# Altium project driver.PrjPcb
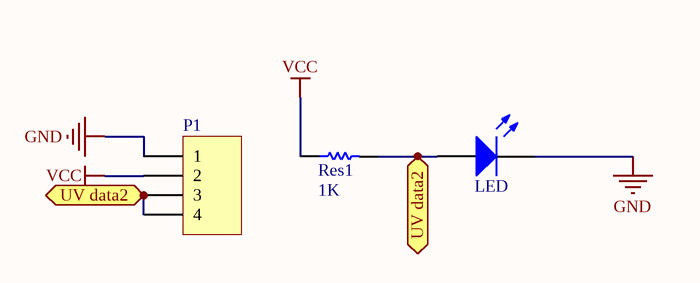
[diagram p0: driver.SchDoc]
1 sheet, 3 parts. Net scope: flat (ports and power ports of the same name join across sheets).
Board file: driver.PcbDoc

## Sheet driver.SchDoc
size A4

### Parts
1k  Res1  value 1K  [AXIAL-0.3]
led  LED  [My_LED3MM]
P1  Header 4  [My_1X04]  (value not drawn)

### Ports
UV data2

### Nets
GND: led.K P1.1
VCC: 1k.1 P1.2
Net1k_2: 1k.2 led.A P1.3 P1.4 ; port UV data2

### Library data of the parts
1k = Res1: Resistor
led = LED: Typical INFRARED GaAs LED
P1 = Header 4: Header, 4-Pin; LatestRevisionDate: 17-Jul-2002; LatestRevisionNote: Re-released for DXP Platform.; Publisher: Altium Limited